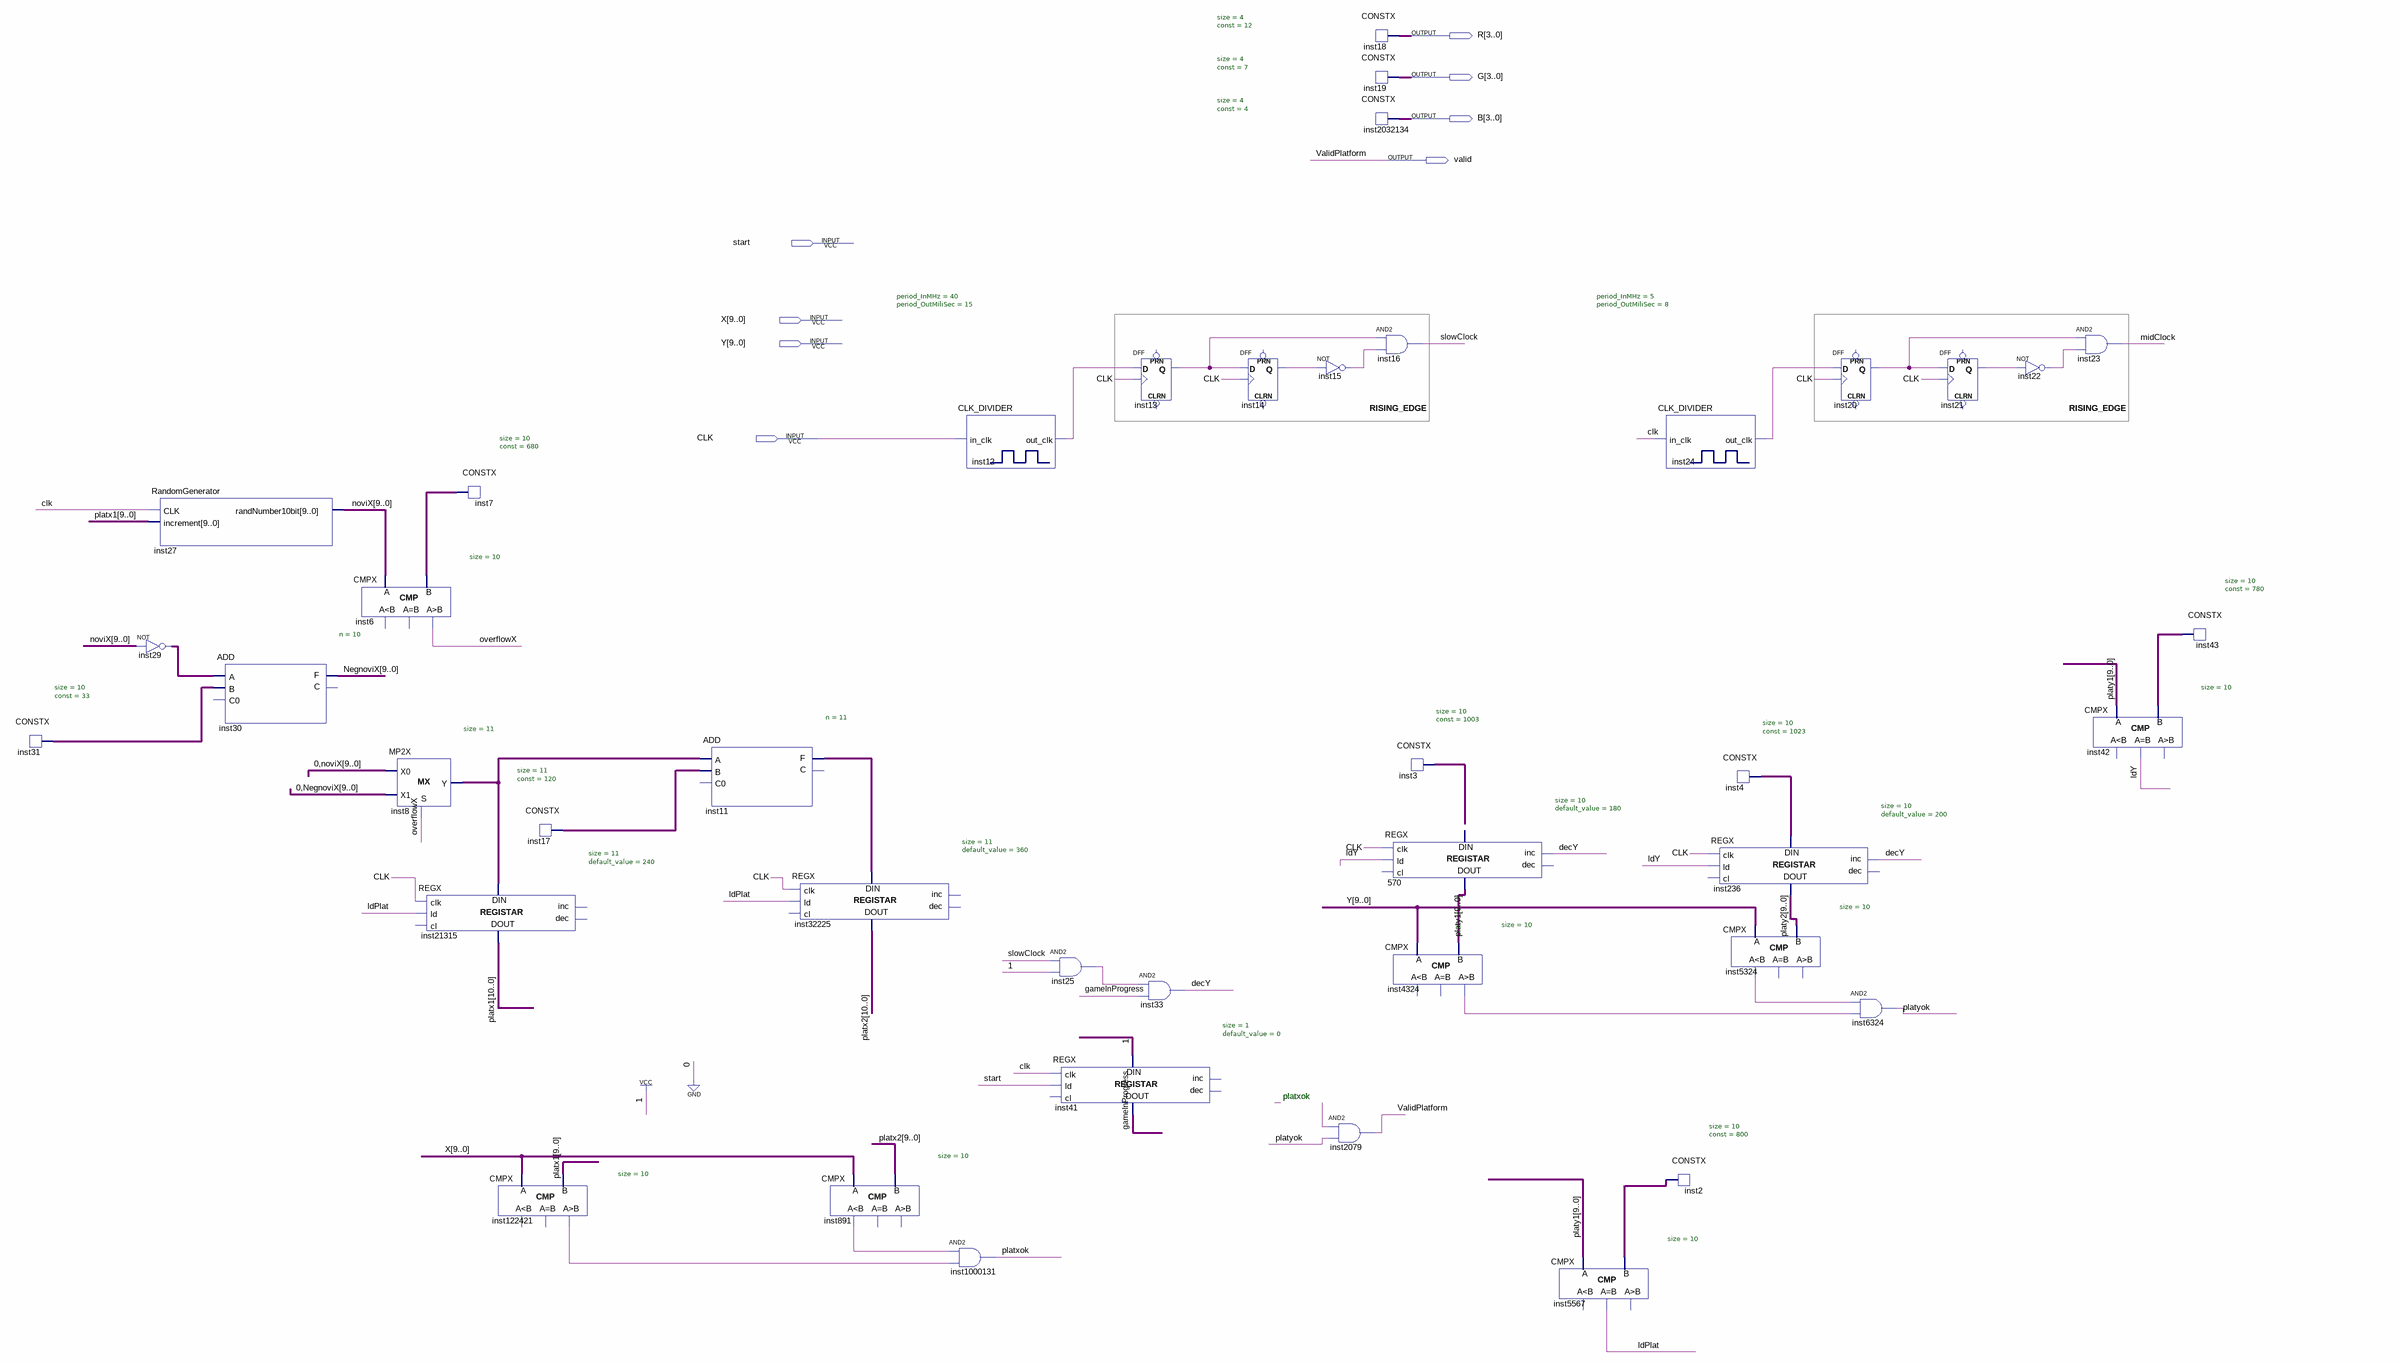
[diagram p0: schematic sheet]
// Quartus schematic Platform2.bdf as structural Verilog: 42 symbols, 8 pins
module Platform2 (
  input  start,
  input  [9:0] X,
  input  [9:0] Y,
  input  CLK,
  output [3:0] R,
  output [3:0] G,
  output [3:0] B,
  output valid
);

  wire decY, gameInProgress, inst12_out_clk, inst13_q, inst14_q, inst15_out, inst20_q, inst21_q, inst22_out,
       inst24_out_clk, inst25_out, inst891_ls, inst4324_gr, inst5324_ls, inst122421_gr, ldPlat, ldY,
       midClock, overflowX, platxok, platyok, slowClock, undriven;
  wire [9:0] inst2_data, inst3_data, inst4_data, inst7_data, inst29_out, inst31_data, inst43_data, NegnoviX,
       noviX, platy1, platy2;
  wire [10:0] inst8_y, inst11_f, inst17_data, platx1, platx2;

  CONSTX #(.size(10), .\const (33)) inst31 (.data(inst31_data));
  RandomGenerator inst27 (.CLK(CLK), .increment(platx1[9:0]), .randNumber10bit(noviX));
  assign inst29_out = ~noviX;  // NOT inst29, 10 bits wide
  ADD #(.n(10)) inst30 (.A(inst29_out), .B(inst31_data), .F(NegnoviX));  // open: C0, C
  CMPX #(.size(10)) inst6 (.A(noviX), .B(inst7_data), .gr(overflowX));  // open: ls, eq
  MP2X #(.size(11)) inst8 (.S(overflowX), .X0({1'b0, noviX}), .X1({1'b0, NegnoviX}), .Y(inst8_y));
  REGX #(.size(11), .default_value(240)) inst21315 (
    .clk(CLK), .ld(ldPlat), .data_in(inst8_y), .data_out(platx1));  // open: cl, inc, dec
  CONSTX #(.size(10), .\const (680)) inst7 (.data(inst7_data));
  CMPX #(.size(10)) inst122421 (.A(X), .B(platx1[9:0]), .gr(inst122421_gr));  // open: ls, eq
  CONSTX #(.size(11), .\const (120)) inst17 (.data(inst17_data));
  ADD #(.n(11)) inst11 (.A(inst8_y), .B(inst17_data), .F(inst11_f));  // open: C0, C
  REGX #(.size(11), .default_value(360)) inst32225 (
    .clk(CLK), .ld(ldPlat), .data_in(inst11_f), .data_out(platx2));  // open: cl, inc, dec
  CMPX #(.size(10)) inst891 (.A(X), .B(platx2[9:0]), .ls(inst891_ls));  // open: eq, gr
  CLK_DIVIDER #(.period_InMHz(40), .period_OutMiliSec(15)) inst12 (.in_clk(CLK), .out_clk(inst12_out_clk));
  and inst1000131 (platxok, inst891_ls, inst122421_gr);
  and inst25 (inst25_out, slowClock, 1'b1);
  REGX #(.size(1), .default_value(0)) inst41 (
    .clk(CLK), .ld(start), .data_in(1'b1), .data_out(gameInProgress));  // open: cl, inc, dec
  DFF inst13 (.CLK(CLK), .D(inst12_out_clk), .Q(inst13_q));  // open: CLRN, PRN
  and inst33 (decY, inst25_out, gameInProgress);
  DFF inst14 (.CLK(CLK), .D(inst13_q), .Q(inst14_q));  // open: CLRN, PRN
  not inst15 (inst15_out, inst14_q);
  and inst2079 (valid, undriven, platyok);
  CONSTX #(.size(4), .\const (12)) inst18 (.data(R));
  CONSTX #(.size(4), .\const (7)) inst19 (.data(G));
  CONSTX #(.size(4), .\const (4)) inst2032134 (.data(B));
  and inst16 (slowClock, inst13_q, inst15_out);
  REGX #(.size(10), .default_value(180)) u_570 (
    .clk(CLK), .ld(ldY), .inc(decY), .data_out(platy1));  // open: cl, dec, data_in
  CMPX #(.size(10)) inst4324 (.A(Y), .B(platy1), .gr(inst4324_gr));  // open: ls, eq
  CONSTX #(.size(10), .\const (1003)) inst3 (.data(inst3_data));
  CMPX #(.size(10)) inst5567 (.A(platy1), .B(inst2_data), .eq(ldPlat));  // open: ls, gr
  CLK_DIVIDER #(.period_InMHz(5), .period_OutMiliSec(8)) inst24 (.in_clk(CLK), .out_clk(inst24_out_clk));
  CONSTX #(.size(10), .\const (800)) inst2 (.data(inst2_data));
  CONSTX #(.size(10), .\const (1023)) inst4 (.data(inst4_data));
  REGX #(.size(10), .default_value(200)) inst236 (
    .clk(CLK), .ld(ldY), .inc(decY), .data_in(inst4_data), .data_out(platy2));  // open: cl, dec
  CMPX #(.size(10)) inst5324 (.A(Y), .B(platy2), .ls(inst5324_ls));  // open: eq, gr
  DFF inst20 (.CLK(CLK), .D(inst24_out_clk), .Q(inst20_q));  // open: CLRN, PRN
  and inst6324 (platyok, inst5324_ls, inst4324_gr);
  DFF inst21 (.CLK(CLK), .D(inst20_q), .Q(inst21_q));  // open: CLRN, PRN
  not inst22 (inst22_out, inst21_q);
  and inst23 (midClock, inst20_q, inst22_out);
  CMPX #(.size(10)) inst42 (.A(platy1), .B(inst43_data), .eq(ldY));  // open: ls, gr
  CONSTX #(.size(10), .\const (780)) inst43 (.data(inst43_data));

  // Other names for the same wires on the sheet: ValidPlatform = valid

  // Notes on the sheet:
  //   RISING_EDGE
  //   RISING_EDGE
  //   platxok
endmodule
